# Altium project ThermalCam_Sensor.PrjPcb
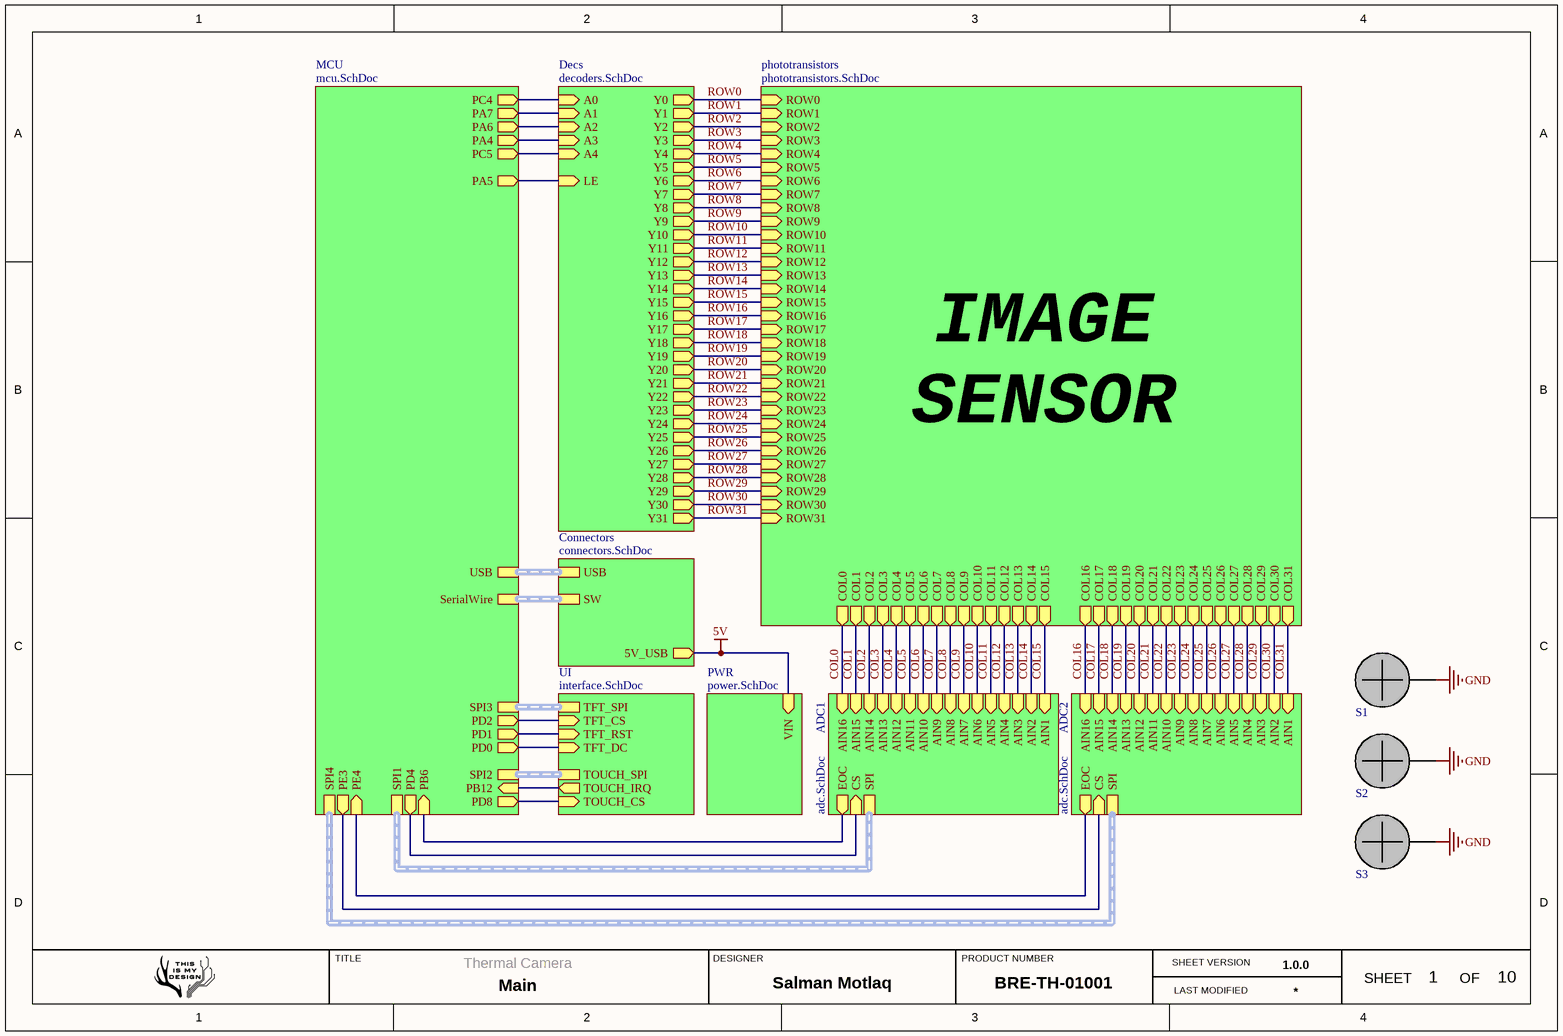
[diagram p0: main.SchDoc]
Des: Salman Motlaq; PN: BRE-TH-01001; Prj: Thermal Camera
9 sheets, 185 parts. Net scope: hierarchical (ports join the sheet entries above them; power ports are global).
Board file: thermal_cam_sensor_jlc.PcbDoc
Sheets:
  main.SchDoc
    ADC1 = adc.SchDoc
    ADC2 = adc.SchDoc
    Decs = decoders.SchDoc
      Dec0 = decoder.SchDoc
      Dec1 = decoder.SchDoc
      Dec2 = decoder.SchDoc
      Dec3 = decoder.SchDoc
      Not1 = not.SchDoc
      Not2 = not.SchDoc
    MCU = mcu.SchDoc
    UI = interface.SchDoc
    PWR = power.SchDoc
    Connectors = connectors.SchDoc

## Sheet main.SchDoc: Main
size A4; Revision: 1.0.0; SheetNumber: 1; SheetTotal: 10

### Parts
S1  Screw  [M3]  (value not drawn)  (no BOM)
S2  Screw  [M3]  (value not drawn)  (no BOM)
S3  Screw  [M3]  (value not drawn)  (no BOM)

### Sub-sheets
ADC1 = adc.SchDoc: AIN1 (in), AIN2 (in), AIN3 (in), AIN4 (in), AIN5 (in), AIN6 (in), AIN7 (in), AIN8 (in), AIN9 (in), AIN10 (in), AIN11 (in), AIN12 (in), AIN13 (in), AIN14 (in), AIN15 (in), AIN16 (in), CS (in), EOC (out), SPI (harness SPI)
ADC2 = adc.SchDoc: AIN1 (in), AIN2 (in), AIN3 (in), AIN4 (in), AIN5 (in), AIN6 (in), AIN7 (in), AIN8 (in), AIN9 (in), AIN10 (in), AIN11 (in), AIN12 (in), AIN13 (in), AIN14 (in), AIN15 (in), AIN16 (in), CS (in), EOC (out), SPI (harness SPI)
Connectors = connectors.SchDoc: USB (harness USB), 5V_USB (out), SW (harness SerialWire)
Decs = decoders.SchDoc: Y0 (out), Y1 (out), Y2 (out), Y3 (out), Y4 (out), Y5 (out), Y6 (out), Y7 (out), Y8 (out), Y9 (out), Y10 (out), Y11 (out), Y12 (out), Y13 (out), Y14 (out), Y15 (out), Y16 (out), Y17 (out), Y18 (out), Y19 (out), Y20 (out), Y21 (out), Y22 (out), Y23 (out), Y24 (out), Y25 (out), Y26 (out), Y27 (out), Y28 (out), Y29 (out), Y30 (out), Y31 (out), A0 (in), A1 (in), A2 (in), A3 (in), A4 (in), LE (in)
MCU = mcu.SchDoc: SPI1 (harness SPI), SPI4 (harness SPI), SPI2 (harness SPI), SPI3 (harness SPI), USB (harness USB), SerialWire (harness SerialWire), PD8 (out), PD0 (out), PD1 (out), PD2 (out), PB12 (in), PA4 (out), PA5 (out), PA6 (out), PA7 (out), PC4 (out), PC5 (out), PB6 (in), PD4 (out), PE4 (in), PE3 (out)
phototransistors = phototransistors.SchDoc (file not in this document): ROW1 (in), ROW2 (in), ROW3 (in), ROW4 (in), ROW5 (in), ROW6 (in), ROW7 (in), ROW8 (in), ROW9 (in), ROW10 (in), ROW11 (in), ROW12 (in), ROW13 (in), ROW14 (in), ROW15 (in), ROW16 (in), ROW17 (in), ROW18 (in), ROW19 (in), ROW20 (in), ROW21 (in), ROW22 (in), ROW23 (in), ROW24 (in), ROW25 (in), ROW26 (in), ROW27 (in), ROW28 (in), ROW29 (in), ROW30 (in), ROW31 (in), ROW0 (in), COL1 (out), COL2 (out), COL3 (out), COL4 (out), COL5 (out), COL6 (out), COL7 (out), COL8 (out), COL9 (out), COL10 (out), COL11 (out), COL12 (out), COL13 (out), COL14 (out), COL15 (out), COL0 (out), COL16 (out), COL17 (out), COL18 (out), COL19 (out), COL20 (out), COL21 (out), COL22 (out), COL23 (out), COL24 (out), COL25 (out), COL26 (out), COL27 (out), COL28 (out), COL29 (out), COL30 (out), COL31 (out)
PWR = power.SchDoc: VIN (in)
UI = interface.SchDoc: TFT_CS (in), TFT_RST (in), TFT_DC (in), TOUCH_CS (in), TOUCH_IRQ (out), TFT_SPI (harness SPI), TOUCH_SPI (harness SPI)

### Nets
5V: sheet PWR/VIN, sheet Connectors/5V_USB
GND: S1.0 S2.0 S3.0
A0: sheet Decs/A0, sheet MCU/PC4
A1: sheet Decs/A1, sheet MCU/PA7
A2: sheet Decs/A2, sheet MCU/PA6
A3: sheet Decs/A3, sheet MCU/PA4
A4: sheet Decs/A4, sheet MCU/PC5
COL0: sheet phototransistors/COL0, sheet ADC1/AIN16
COL1: sheet phototransistors/COL1, sheet ADC1/AIN15
COL2: sheet phototransistors/COL2, sheet ADC1/AIN14
COL3: sheet phototransistors/COL3, sheet ADC1/AIN13
COL4: sheet phototransistors/COL4, sheet ADC1/AIN12
COL5: sheet phototransistors/COL5, sheet ADC1/AIN11
COL6: sheet phototransistors/COL6, sheet ADC1/AIN10
COL7: sheet phototransistors/COL7, sheet ADC1/AIN9
COL8: sheet phototransistors/COL8, sheet ADC1/AIN8
COL9: sheet phototransistors/COL9, sheet ADC1/AIN7
COL10: sheet phototransistors/COL10, sheet ADC1/AIN6
COL11: sheet phototransistors/COL11, sheet ADC1/AIN5
COL12: sheet phototransistors/COL12, sheet ADC1/AIN4
COL13: sheet phototransistors/COL13, sheet ADC1/AIN3
COL14: sheet phototransistors/COL14, sheet ADC1/AIN2
COL15: sheet phototransistors/COL15, sheet ADC1/AIN1
COL16: sheet phototransistors/COL16, sheet ADC2/AIN16
COL17: sheet phototransistors/COL17, sheet ADC2/AIN15
COL18: sheet phototransistors/COL18, sheet ADC2/AIN14
COL19: sheet phototransistors/COL19, sheet ADC2/AIN13
COL20: sheet phototransistors/COL20, sheet ADC2/AIN12
COL21: sheet phototransistors/COL21, sheet ADC2/AIN11
COL22: sheet phototransistors/COL22, sheet ADC2/AIN10
COL23: sheet phototransistors/COL23, sheet ADC2/AIN9
COL24: sheet phototransistors/COL24, sheet ADC2/AIN8
COL25: sheet phototransistors/COL25, sheet ADC2/AIN7
COL26: sheet phototransistors/COL26, sheet ADC2/AIN6
COL27: sheet phototransistors/COL27, sheet ADC2/AIN5
COL28: sheet phototransistors/COL28, sheet ADC2/AIN4
COL29: sheet phototransistors/COL29, sheet ADC2/AIN3
COL30: sheet phototransistors/COL30, sheet ADC2/AIN2
COL31: sheet phototransistors/COL31, sheet ADC2/AIN1
LE: sheet Decs/LE, sheet MCU/PA5
ROW0: sheet phototransistors/ROW0, sheet Decs/Y0
ROW1: sheet phototransistors/ROW1, sheet Decs/Y1
ROW2: sheet phototransistors/ROW2, sheet Decs/Y2
ROW3: sheet phototransistors/ROW3, sheet Decs/Y3
ROW4: sheet phototransistors/ROW4, sheet Decs/Y4
ROW5: sheet phototransistors/ROW5, sheet Decs/Y5
ROW6: sheet phototransistors/ROW6, sheet Decs/Y6
ROW7: sheet phototransistors/ROW7, sheet Decs/Y7
ROW8: sheet phototransistors/ROW8, sheet Decs/Y8
ROW9: sheet phototransistors/ROW9, sheet Decs/Y9
ROW10: sheet phototransistors/ROW10, sheet Decs/Y10
ROW11: sheet phototransistors/ROW11, sheet Decs/Y11
ROW12: sheet phototransistors/ROW12, sheet Decs/Y12
ROW13: sheet phototransistors/ROW13, sheet Decs/Y13
ROW14: sheet phototransistors/ROW14, sheet Decs/Y14
ROW15: sheet phototransistors/ROW15, sheet Decs/Y15
ROW16: sheet phototransistors/ROW16, sheet Decs/Y16
ROW17: sheet phototransistors/ROW17, sheet Decs/Y17
ROW18: sheet phototransistors/ROW18, sheet Decs/Y18
ROW19: sheet phototransistors/ROW19, sheet Decs/Y19
ROW20: sheet phototransistors/ROW20, sheet Decs/Y20
ROW21: sheet phototransistors/ROW21, sheet Decs/Y21
ROW22: sheet phototransistors/ROW22, sheet Decs/Y22
ROW23: sheet phototransistors/ROW23, sheet Decs/Y23
ROW24: sheet phototransistors/ROW24, sheet Decs/Y24
ROW25: sheet phototransistors/ROW25, sheet Decs/Y25
ROW26: sheet phototransistors/ROW26, sheet Decs/Y26
ROW27: sheet phototransistors/ROW27, sheet Decs/Y27
ROW28: sheet phototransistors/ROW28, sheet Decs/Y28
ROW29: sheet phototransistors/ROW29, sheet Decs/Y29
ROW30: sheet phototransistors/ROW30, sheet Decs/Y30
ROW31: sheet phototransistors/ROW31, sheet Decs/Y31
Net1U1_20: sheet ADC1/CS, sheet MCU/PD4
Net1U1_25: sheet ADC1/EOC, sheet MCU/PB6
Net2U1_20: sheet ADC2/CS, sheet MCU/PE3
Net2U1_25: sheet ADC2/EOC, sheet MCU/PE4
NetLCD1_3: sheet MCU/PD2, sheet UI/TFT_CS
NetLCD1_4: sheet MCU/PD1, sheet UI/TFT_RST
NetLCD1_5: sheet MCU/PD0, sheet UI/TFT_DC
NetLCD1_11: sheet MCU/PD8, sheet UI/TOUCH_CS
NetLCD1_14: sheet MCU/PB12, sheet UI/TOUCH_IRQ

### Buses and harness runs
harness sheet ADC1/SPI = sheet MCU/SPI1
harness sheet ADC2/SPI = sheet MCU/SPI4
harness sheet Connectors/SW = sheet MCU/SerialWire
harness sheet Connectors/USB = sheet MCU/USB
harness sheet MCU/SPI2 = sheet UI/TOUCH_SPI
harness sheet MCU/SPI3 = sheet UI/TFT_SPI

### Notes on the sheet
- IMAGE
  SENSOR
- TITLE
- DESIGNER
- PRODUCT NUMBER
- SHEET VERSION
- LAST MODIFIED
- SHEET
- OF

## Sheet adc.SchDoc: 16 Channel ADC
size A4; Revision: 1.0.0; SheetNumber: 3; SheetTotal: 10
Used 2 times, as channels ADC1, ADC2. Parts and nets are listed once, with the designators drawn on the sheet.
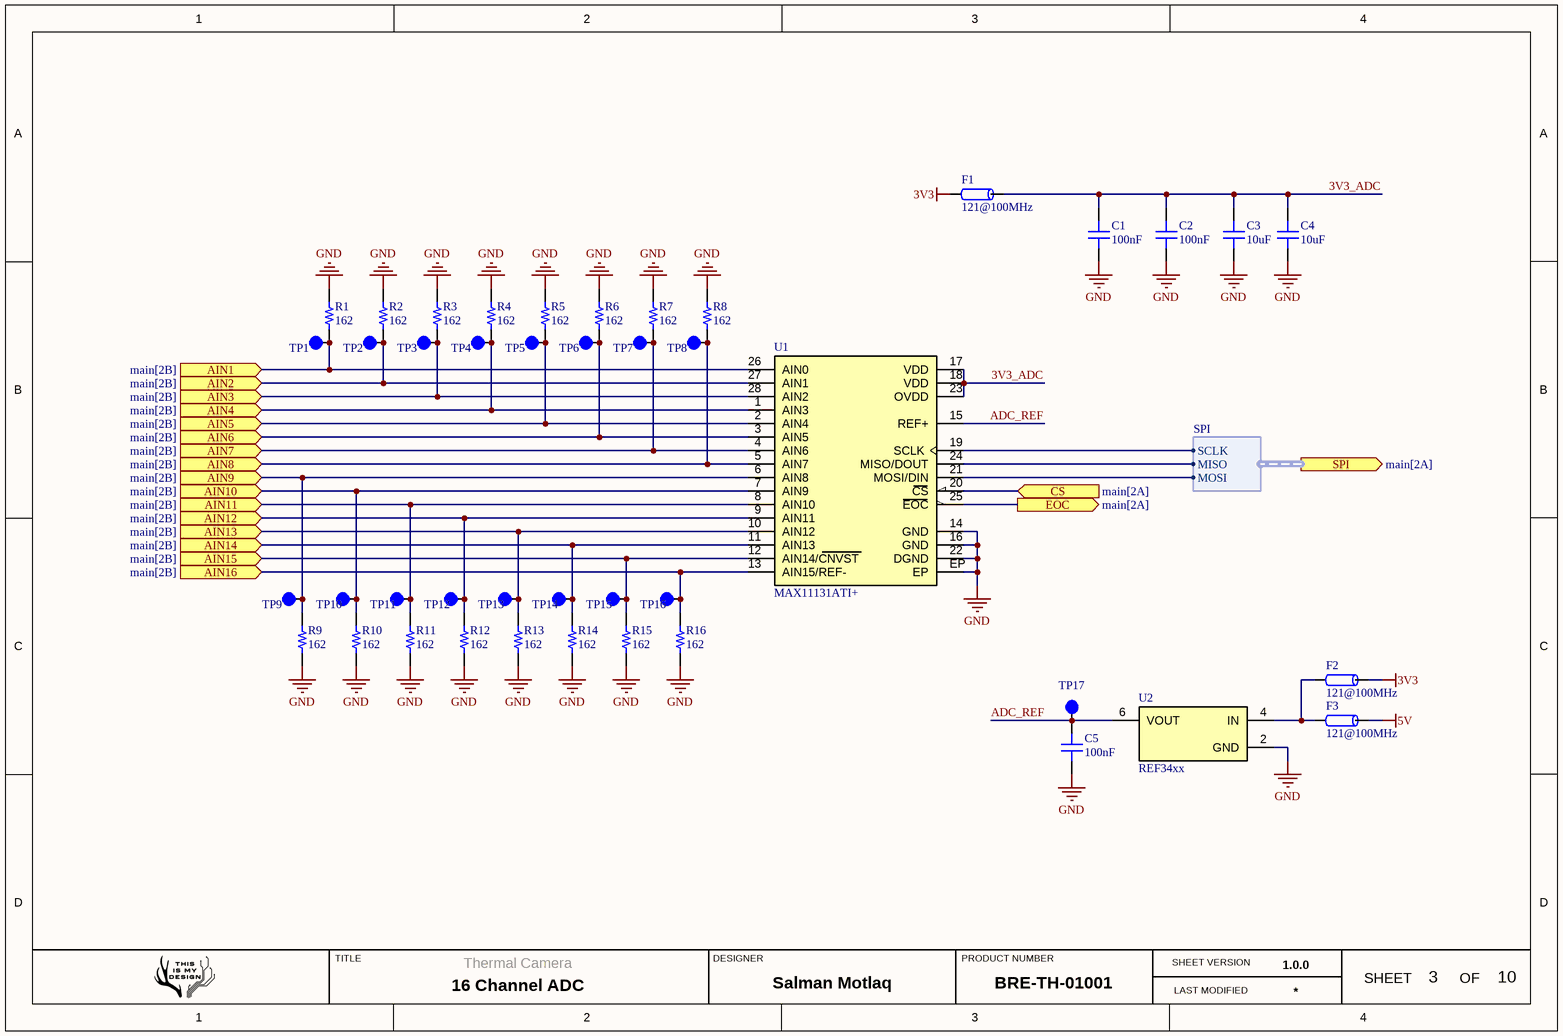
[diagram p1: adc.SchDoc]

### Parts
C1  100nF  [CAP 0603_1608]
C2  100nF  [CAP 0603_1608]
C3  10uF  [CAP 0603_1608]
C4  10uF  [CAP 0603_1608]
C5  100nF  [CAP 0603_1608]
F1  121@100MHz  [Ferrite-0805]
F2  121@100MHz  [Ferrite-0805]
F3  121@100MHz  [Ferrite-0805]
R1  162  [RES 0402_1005]
R2  162  [RES 0402_1005]
R3  162  [RES 0402_1005]
R4  162  [RES 0402_1005]
R5  162  [RES 0402_1005]
R6  162  [RES 0402_1005]
R7  162  [RES 0402_1005]
R8  162  [RES 0402_1005]
R9  162  [RES 0402_1005]
R10  162  [RES 0402_1005]
R11  162  [RES 0402_1005]
R12  162  [RES 0402_1005]
R13  162  [RES 0402_1005]
R14  162  [RES 0402_1005]
R15  162  [RES 0402_1005]
R16  162  [RES 0402_1005]
TP1  Test Point  [TEST_POINT_0R5]  (value not drawn)  (no BOM)
TP2  Test Point  [TEST_POINT_0R5]  (value not drawn)  (no BOM)
TP3  Test Point  [TEST_POINT_0R5]  (value not drawn)  (no BOM)
TP4  Test Point  [TEST_POINT_0R5]  (value not drawn)  (no BOM)
TP5  Test Point  [TEST_POINT_0R5]  (value not drawn)  (no BOM)
TP6  Test Point  [TEST_POINT_0R5]  (value not drawn)  (no BOM)
TP7  Test Point  [TEST_POINT_0R5]  (value not drawn)  (no BOM)
TP8  Test Point  [TEST_POINT_0R5]  (value not drawn)  (no BOM)
TP9  Test Point  [TEST_POINT_0R5]  (value not drawn)  (no BOM)
TP10  Test Point  [TEST_POINT_0R5]  (value not drawn)  (no BOM)
TP11  Test Point  [TEST_POINT_0R5]  (value not drawn)  (no BOM)
TP12  Test Point  [TEST_POINT_0R5]  (value not drawn)  (no BOM)
TP13  Test Point  [TEST_POINT_0R5]  (value not drawn)  (no BOM)
TP14  Test Point  [TEST_POINT_0R5]  (value not drawn)  (no BOM)
TP15  Test Point  [TEST_POINT_0R5]  (value not drawn)  (no BOM)
TP16  Test Point  [TEST_POINT_0R5]  (value not drawn)  (no BOM)
TP17  Test Point  [TEST_POINT_0R5]  (value not drawn)  (no BOM)
U1  MAX11131ATI+  [TQFN-28]
U2  REF34xx  [SOT23-6L]

### Ports
AIN1 (in, see main[2B]), AIN2 (in, see main[2B]), AIN3 (in, see main[2B]), AIN4 (in, see main[2B]), AIN5 (in, see main[2B]), AIN6 (in, see main[2B]), AIN7 (in, see main[2B]), AIN8 (in, see main[2B]), AIN9 (in, see main[2B]), AIN10 (in, see main[2B]), AIN11 (in, see main[2B]), AIN12 (in, see main[2B]), AIN13 (in, see main[2B]), AIN14 (in, see main[2B]), AIN15 (in, see main[2B]), AIN16 (in, see main[2B]), CS (in, see main[2A]), EOC (out, see main[2A]), SPI (out, harness SPI, see main[2A])

### Harnesses
SPI: SCLK, MISO, MOSI

### Nets
3V3: F1.1 F2.2
5V: F3.2
GND: C1.1 C2.1 C3.1 C4.1 C5.1 R1.2 R2.2 R3.2 R4.2 R5.2 R6.2 R7.2 R8.2 R9.1 R10.1 R11.1 R12.1 R13.1 R14.1 R15.1 R16.1 U1.14(GND) U1.16(GND) U1.22(DGND) U1.EP U2.2(GND)
3V3_ADC: C1.2 C2.2 C3.2 C4.2 F1.2 U1.17(VDD) U1.18(VDD) U1.23(OVDD)
ADC_REF: C5.2 TP17.0 U1.15(REF+) U2.6(VOUT)
AIN1: R1.1 TP1.0 U1.26(AIN0) ; port AIN1
AIN2: R2.1 TP2.0 U1.27(AIN1) ; port AIN2
AIN3: R3.1 TP3.0 U1.28(AIN2) ; port AIN3
AIN4: R4.1 TP4.0 U1.1(AIN3) ; port AIN4
AIN5: R5.1 TP5.0 U1.2(AIN4) ; port AIN5
AIN6: R6.1 TP6.0 U1.3(AIN5) ; port AIN6
AIN7: R7.1 TP7.0 U1.4(AIN6) ; port AIN7
AIN8: R8.1 TP8.0 U1.5(AIN7) ; port AIN8
AIN9: R9.2 TP9.0 U1.6(AIN8) ; port AIN9
AIN10: R10.2 TP10.0 U1.7(AIN9) ; port AIN10
AIN11: R11.2 TP11.0 U1.8(AIN10) ; port AIN11
AIN12: R12.2 TP12.0 U1.9(AIN11) ; port AIN12
AIN13: R13.2 TP13.0 U1.10(AIN12) ; port AIN13
AIN14: R14.2 TP14.0 U1.11(AIN13) ; port AIN14
AIN15: R15.2 TP15.0 U1.12(AIN14/CNVST) ; port AIN15
AIN16: R16.2 TP16.0 U1.13(AIN15/REF-) ; port AIN16
CS: U1.20(CS) ; port CS
EOC: U1.25(EOC) ; port EOC
NetF2_1: F2.1 F3.1 U2.4(IN)
NetU1_19: U1.19(SCLK) ; port SPI.SCLK
NetU1_21: U1.21(MOSI/DIN) ; port SPI.MOSI
NetU1_24: U1.24(MISO/DOUT) ; port SPI.MISO

### Channels
ADC1: designators C1=1C1 C2=1C2 C3=1C3 C4=1C4 C5=1C5 F1=1F1 F2=1F2 F3=1F3 R1=1R1 R2=1R2 R3=1R3 R4=1R4 R5=1R5 R6=1R6 R7=1R7 R8=1R8 R9=1R9 R10=1R10 R11=1R11 R12=1R12 R13=1R13 R14=1R14 R15=1R15 R16=1R16 TP1=1TP1 TP2=1TP2 TP3=1TP3 TP4=1TP4 TP5=1TP5 TP6=1TP6 TP7=1TP7 TP8=1TP8 TP9=1TP9 TP10=1TP10 TP11=1TP11 TP12=1TP12 TP13=1TP13 TP14=1TP14 TP15=1TP15 TP16=1TP16 TP17=1TP17 U1=1U1 U2=1U2; ports AIN1=COL15 AIN2=COL14 AIN3=COL13 AIN4=COL12 AIN5=COL11 AIN6=COL10 AIN7=COL9 AIN8=COL8 AIN9=COL7 AIN10=COL6 AIN11=COL5 AIN12=COL4 AIN13=COL3 AIN14=COL2 AIN15=COL1 AIN16=COL0 CS=Net1U1_20 EOC=Net1U1_25
ADC2: designators C1=2C1 C2=2C2 C3=2C3 C4=2C4 C5=2C5 F1=2F1 F2=2F2 F3=2F3 R1=2R1 R2=2R2 R3=2R3 R4=2R4 R5=2R5 R6=2R6 R7=2R7 R8=2R8 R9=2R9 R10=2R10 R11=2R11 R12=2R12 R13=2R13 R14=2R14 R15=2R15 R16=2R16 TP1=2TP1 TP2=2TP2 TP3=2TP3 TP4=2TP4 TP5=2TP5 TP6=2TP6 TP7=2TP7 TP8=2TP8 TP9=2TP9 TP10=2TP10 TP11=2TP11 TP12=2TP12 TP13=2TP13 TP14=2TP14 TP15=2TP15 TP16=2TP16 TP17=2TP17 U1=2U1 U2=2U2; ports AIN1=COL31 AIN2=COL30 AIN3=COL29 AIN4=COL28 AIN5=COL27 AIN6=COL26 AIN7=COL25 AIN8=COL24 AIN9=COL23 AIN10=COL22 AIN11=COL21 AIN12=COL20 AIN13=COL19 AIN14=COL18 AIN15=COL17 AIN16=COL16 CS=Net2U1_20 EOC=Net2U1_25

### Notes on the sheet
- TITLE
- DESIGNER
- PRODUCT NUMBER
- SHEET VERSION
- LAST MODIFIED
- SHEET
- OF

### Library data of the parts
C1-C5 = Cap 0603: SMT Capacitor
  C1 C2 C5: VALUE: 100nF
  C3 C4: VALUE: 10uF
F1-F3 = Ferrite Bead
R1-R16 = Res 0402: SMT Resistor; VALUE: 162
TP1-TP17 = Test Point: PCB Test Point
U1 = MAX11131: Analog to Digital Converters - ADC Pin-/Software-Compatible Family of 10-/12-Bit, 8-/16-Channel, 3Msps ADCs with External Reference
U2 = REF34xx: Voltage References low-drift, low-power

## Sheet decoders.SchDoc: 5-to-32 Decoder
size A4; Revision: 1.0.0; SheetNumber: 4; SheetTotal: 10
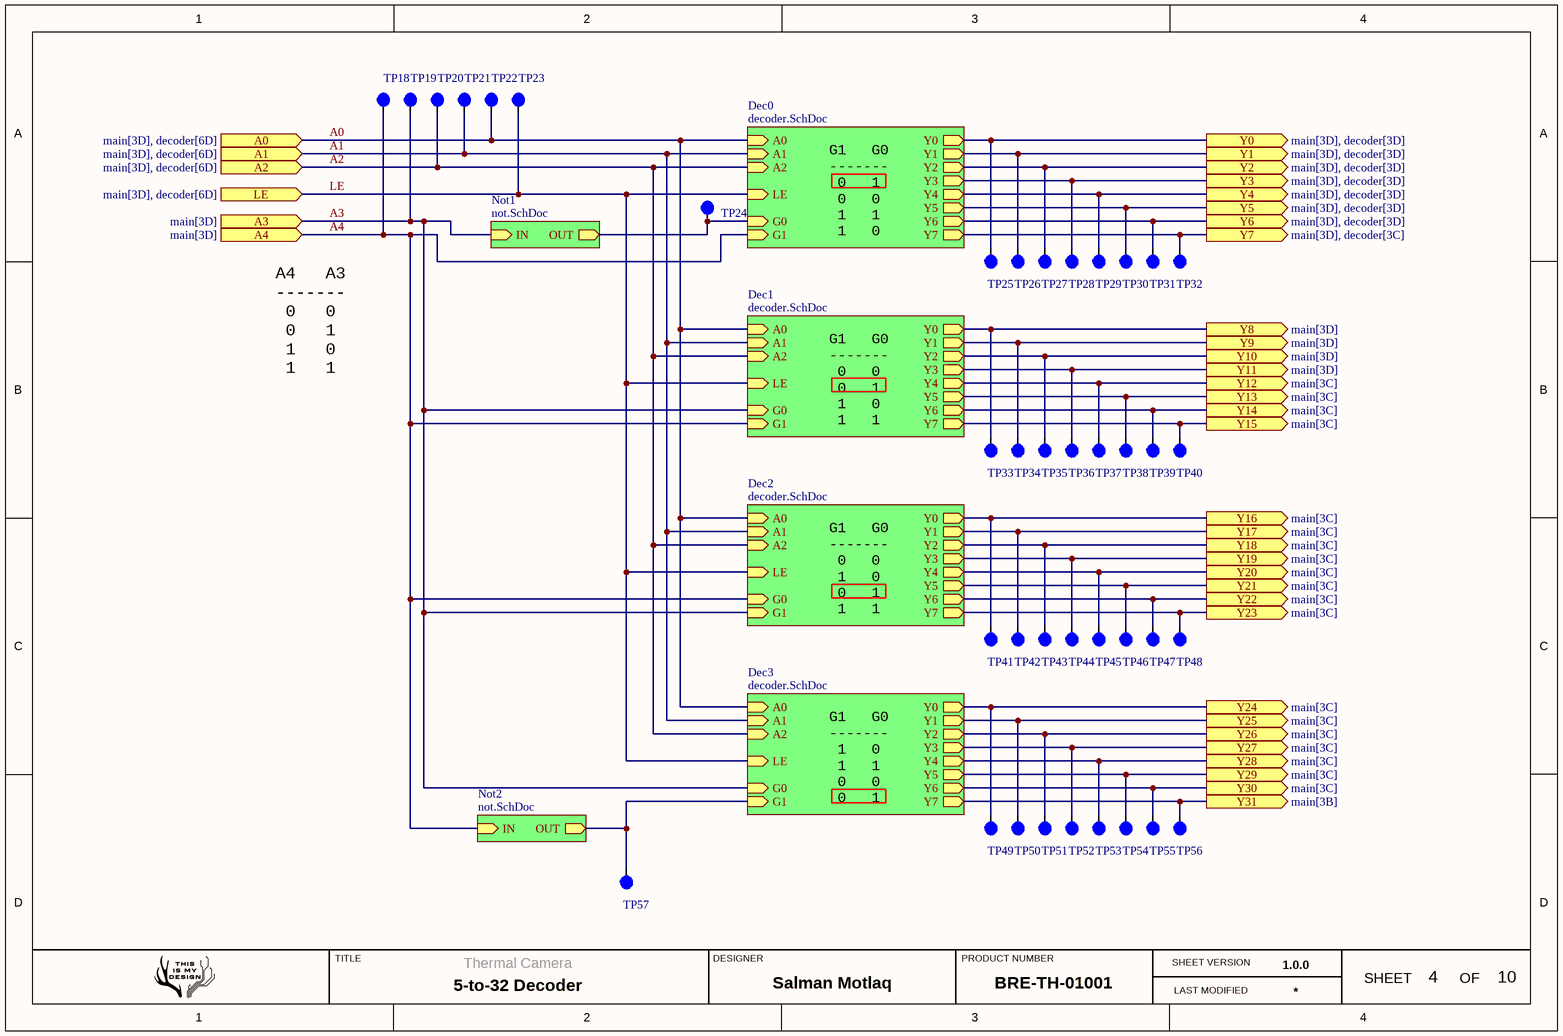
[diagram p2: decoders.SchDoc]

### Parts
TP18  Test Point  [TEST_POINT_0R5]  (value not drawn)  (no BOM)
TP19  Test Point  [TEST_POINT_0R5]  (value not drawn)  (no BOM)
TP20  Test Point  [TEST_POINT_0R5]  (value not drawn)  (no BOM)
TP21  Test Point  [TEST_POINT_0R5]  (value not drawn)  (no BOM)
TP22  Test Point  [TEST_POINT_0R5]  (value not drawn)  (no BOM)
TP23  Test Point  [TEST_POINT_0R5]  (value not drawn)  (no BOM)
TP24  Test Point  [TEST_POINT_0R5]  (value not drawn)  (no BOM)
TP25  Test Point  [TEST_POINT_0R5]  (value not drawn)  (no BOM)
TP26  Test Point  [TEST_POINT_0R5]  (value not drawn)  (no BOM)
TP27  Test Point  [TEST_POINT_0R5]  (value not drawn)  (no BOM)
TP28  Test Point  [TEST_POINT_0R5]  (value not drawn)  (no BOM)
TP29  Test Point  [TEST_POINT_0R5]  (value not drawn)  (no BOM)
TP30  Test Point  [TEST_POINT_0R5]  (value not drawn)  (no BOM)
TP31  Test Point  [TEST_POINT_0R5]  (value not drawn)  (no BOM)
TP32  Test Point  [TEST_POINT_0R5]  (value not drawn)  (no BOM)
TP33  Test Point  [TEST_POINT_0R5]  (value not drawn)  (no BOM)
TP34  Test Point  [TEST_POINT_0R5]  (value not drawn)  (no BOM)
TP35  Test Point  [TEST_POINT_0R5]  (value not drawn)  (no BOM)
TP36  Test Point  [TEST_POINT_0R5]  (value not drawn)  (no BOM)
TP37  Test Point  [TEST_POINT_0R5]  (value not drawn)  (no BOM)
TP38  Test Point  [TEST_POINT_0R5]  (value not drawn)  (no BOM)
TP39  Test Point  [TEST_POINT_0R5]  (value not drawn)  (no BOM)
TP40  Test Point  [TEST_POINT_0R5]  (value not drawn)  (no BOM)
TP41  Test Point  [TEST_POINT_0R5]  (value not drawn)  (no BOM)
TP42  Test Point  [TEST_POINT_0R5]  (value not drawn)  (no BOM)
TP43  Test Point  [TEST_POINT_0R5]  (value not drawn)  (no BOM)
TP44  Test Point  [TEST_POINT_0R5]  (value not drawn)  (no BOM)
TP45  Test Point  [TEST_POINT_0R5]  (value not drawn)  (no BOM)
TP46  Test Point  [TEST_POINT_0R5]  (value not drawn)  (no BOM)
TP47  Test Point  [TEST_POINT_0R5]  (value not drawn)  (no BOM)
TP48  Test Point  [TEST_POINT_0R5]  (value not drawn)  (no BOM)
TP49  Test Point  [TEST_POINT_0R5]  (value not drawn)  (no BOM)
TP50  Test Point  [TEST_POINT_0R5]  (value not drawn)  (no BOM)
TP51  Test Point  [TEST_POINT_0R5]  (value not drawn)  (no BOM)
TP52  Test Point  [TEST_POINT_0R5]  (value not drawn)  (no BOM)
TP53  Test Point  [TEST_POINT_0R5]  (value not drawn)  (no BOM)
TP54  Test Point  [TEST_POINT_0R5]  (value not drawn)  (no BOM)
TP55  Test Point  [TEST_POINT_0R5]  (value not drawn)  (no BOM)
TP56  Test Point  [TEST_POINT_0R5]  (value not drawn)  (no BOM)
TP57  Test Point  [TEST_POINT_0R5]  (value not drawn)  (no BOM)

### Sub-sheets
Dec0 = decoder.SchDoc: Y0 (out), Y1 (out), Y2 (out), Y3 (out), Y4 (out), Y5 (out), Y6 (out), Y7 (out), A0 (in), A1 (in), A2 (in), LE (in), G0 (in), G1 (in)
Dec1 = decoder.SchDoc: Y0 (out), Y1 (out), Y2 (out), Y3 (out), Y4 (out), Y5 (out), Y6 (out), Y7 (out), A0 (in), A1 (in), A2 (in), LE (in), G0 (in), G1 (in)
Dec2 = decoder.SchDoc: Y0 (out), Y1 (out), Y2 (out), Y3 (out), Y4 (out), Y5 (out), Y6 (out), Y7 (out), A0 (in), A1 (in), A2 (in), LE (in), G0 (in), G1 (in)
Dec3 = decoder.SchDoc: Y0 (out), Y1 (out), Y2 (out), Y3 (out), Y4 (out), Y5 (out), Y6 (out), Y7 (out), A0 (in), A1 (in), A2 (in), LE (in), G0 (in), G1 (in)
Not1 = not.SchDoc: IN (in), OUT (out)
Not2 = not.SchDoc: IN (in), OUT (out)

### Ports
A0 (in, see main[3D], decoder[6D]), A1 (in, see main[3D], decoder[6D]), A2 (in, see main[3D], decoder[6D]), A3 (in, see main[3D]), A4 (in, see main[3D]), LE (in, see main[3D], decoder[6D]), Y0 (out, see main[3D], decoder[3D]), Y1 (out, see main[3D], decoder[3D]), Y2 (out, see main[3D], decoder[3D]), Y3 (out, see main[3D], decoder[3D]), Y4 (out, see main[3D], decoder[3D]), Y5 (out, see main[3D], decoder[3D]), Y6 (out, see main[3D], decoder[3D]), Y7 (out, see main[3D], decoder[3C]), Y8 (out, see main[3D]), Y9 (out, see main[3D]), Y10 (out, see main[3D]), Y11 (out, see main[3D]), Y12 (out, see main[3C]), Y13 (out, see main[3C]), Y14 (out, see main[3C]), Y15 (out, see main[3C]), Y16 (out, see main[3C]), Y17 (out, see main[3C]), Y18 (out, see main[3C]), Y19 (out, see main[3C]), Y20 (out, see main[3C]), Y21 (out, see main[3C]), Y22 (out, see main[3C]), Y23 (out, see main[3C]), Y24 (out, see main[3C]), Y25 (out, see main[3C]), Y26 (out, see main[3C]), Y27 (out, see main[3C]), Y28 (out, see main[3C]), Y29 (out, see main[3C]), Y30 (out, see main[3C]), Y31 (out, see main[3B])

### Nets
A0: TP22.0 ; port A0, sheet Dec0/A0, sheet Dec1/A0, sheet Dec2/A0, sheet Dec3/A0
A1: TP21.0 ; port A1, sheet Dec0/A1, sheet Dec1/A1, sheet Dec2/A1, sheet Dec3/A1
A2: TP20.0 ; port A2, sheet Dec0/A2, sheet Dec1/A2, sheet Dec2/A2, sheet Dec3/A2
A3: TP19.0 ; port A3, sheet Dec1/G0, sheet Dec2/G1, sheet Dec3/G0, sheet Not1/IN
A4: TP18.0 ; port A4, sheet Dec0/G1, sheet Dec1/G1, sheet Dec2/G0, sheet Not2/IN
LE: TP23.0 ; port LE, sheet Dec0/LE, sheet Dec1/LE, sheet Dec2/LE, sheet Dec3/LE
ROW0: TP25.0 ; port Y0, sheet Dec0/Y0
ROW1: TP26.0 ; port Y1, sheet Dec0/Y1
ROW2: TP27.0 ; port Y2, sheet Dec0/Y2
ROW3: TP28.0 ; port Y3, sheet Dec0/Y3
ROW4: TP29.0 ; port Y4, sheet Dec0/Y4
ROW5: TP30.0 ; port Y5, sheet Dec0/Y5
ROW6: TP31.0 ; port Y6, sheet Dec0/Y6
ROW7: TP32.0 ; port Y7, sheet Dec0/Y7
ROW8: TP33.0 ; port Y8, sheet Dec1/Y0
ROW9: TP34.0 ; port Y9, sheet Dec1/Y1
ROW10: TP35.0 ; port Y10, sheet Dec1/Y2
ROW11: TP36.0 ; port Y11, sheet Dec1/Y3
ROW12: TP37.0 ; port Y12, sheet Dec1/Y4
ROW13: TP38.0 ; port Y13, sheet Dec1/Y5
ROW14: TP39.0 ; port Y14, sheet Dec1/Y6
ROW15: TP40.0 ; port Y15, sheet Dec1/Y7
ROW16: TP41.0 ; port Y16, sheet Dec2/Y0
ROW17: TP42.0 ; port Y17, sheet Dec2/Y1
ROW18: TP43.0 ; port Y18, sheet Dec2/Y2
ROW19: TP44.0 ; port Y19, sheet Dec2/Y3
ROW20: TP45.0 ; port Y20, sheet Dec2/Y4
ROW21: TP46.0 ; port Y21, sheet Dec2/Y5
ROW22: TP47.0 ; port Y22, sheet Dec2/Y6
ROW23: TP48.0 ; port Y23, sheet Dec2/Y7
ROW24: TP49.0 ; port Y24, sheet Dec3/Y0
ROW25: TP50.0 ; port Y25, sheet Dec3/Y1
ROW26: TP51.0 ; port Y26, sheet Dec3/Y2
ROW27: TP52.0 ; port Y27, sheet Dec3/Y3
ROW28: TP53.0 ; port Y28, sheet Dec3/Y4
ROW29: TP54.0 ; port Y29, sheet Dec3/Y5
ROW30: TP55.0 ; port Y30, sheet Dec3/Y6
ROW31: TP56.0 ; port Y31, sheet Dec3/Y7
Net1U3_6: TP24.0 ; sheet Dec0/G0, sheet Not1/OUT
Net2U4_4: TP57.0 ; sheet Dec3/G1, sheet Not2/OUT

### Notes on the sheet
- G1   G0
  -------
  0   1
  0   0
  1   1
  1   0
- A4   A3
  -------
  0   0
  0   1
  1   0
  1   1
- G1   G0
  -------
  0   0
  0   1
  1   0
  1   1
- G1   G0
  -------
  0   0
  1   0
  0   1
  1   1
- G1   G0
  -------
  1   0
  1   1
  0   0
  0   1
- TITLE
- DESIGNER
- PRODUCT NUMBER
- SHEET VERSION
- LAST MODIFIED
- SHEET
- OF

### Library data of the parts
TP18-TP57 = Test Point: PCB Test Point

## Sheet decoder.SchDoc: 3-to-8 Decoder
size 209 x 148 mm; Revision: 1.0.0; SheetNumber: 5; SheetTotal: 10
Used 4 times, as channels Decs/Dec0, Decs/Dec1, Decs/Dec2, Decs/Dec3. Parts and nets are listed once, with the designators drawn on the sheet.
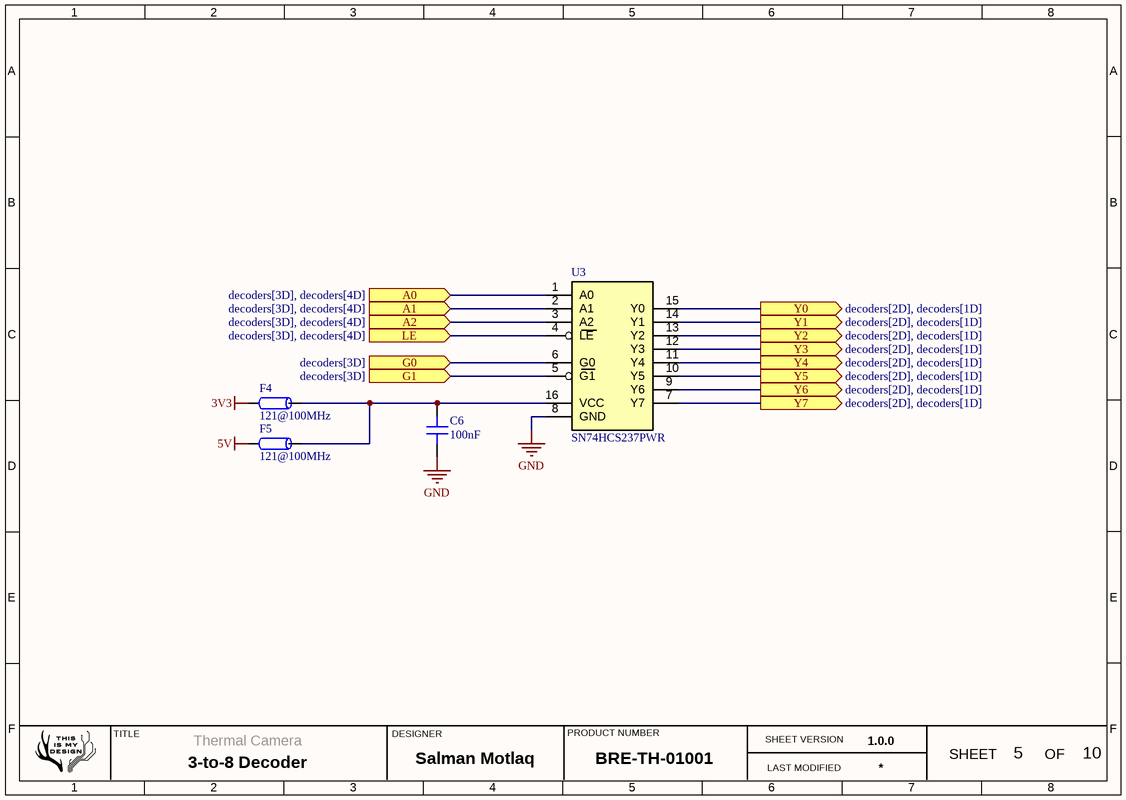
[diagram p3: decoder.SchDoc]

### Parts
C6  100nF  [CAP 0603_1608]
F4  121@100MHz  [Ferrite-0805]
F5  121@100MHz  [Ferrite-0805]
U3  SN74HCS237PWR  [TSSOP-16]

### Ports
A0 (in, see decoders[3D], decoders[4D]), A1 (in, see decoders[3D], decoders[4D]), A2 (in, see decoders[3D], decoders[4D]), G0 (in, see decoders[3D]), G1 (in, see decoders[3D]), LE (in, see decoders[3D], decoders[4D]), Y0 (out, see decoders[2D], decoders[1D]), Y1 (out, see decoders[2D], decoders[1D]), Y2 (out, see decoders[2D], decoders[1D]), Y3 (out, see decoders[2D], decoders[1D]), Y4 (out, see decoders[2D], decoders[1D]), Y5 (out, see decoders[2D], decoders[1D]), Y6 (out, see decoders[2D], decoders[1D]), Y7 (out, see decoders[2D], decoders[1D])

### Nets
3V3: F4.1
5V: F5.1
GND: C6.1 U3.8(GND)
A0: U3.1(A0) ; port A0
A1: U3.2(A1) ; port A1
A2: U3.3(A2) ; port A2
G0: U3.6(G0) ; port G0
G1: U3.5(G1) ; port G1
LE: U3.4(LE) ; port LE
Y0: U3.15(Y0) ; port Y0
Y1: U3.14(Y1) ; port Y1
Y2: U3.13(Y2) ; port Y2
Y3: U3.12(Y3) ; port Y3
Y4: U3.11(Y4) ; port Y4
Y5: U3.10(Y5) ; port Y5
Y6: U3.9(Y6) ; port Y6
Y7: U3.7(Y7) ; port Y7
NetC6_2: C6.2 F4.2 F5.2 U3.16(VCC)

### Channels
Decs/Dec0: designators C6=1C6 F4=1F4 F5=1F5 U3=1U3; ports A0=A0 A1=A1 A2=A2 G0=Net1U3_6 G1=A4 LE=LE Y0=ROW0 Y1=ROW1 Y2=ROW2 Y3=ROW3 Y4=ROW4 Y5=ROW5 Y6=ROW6 Y7=ROW7
Decs/Dec1: designators C6=2C6 F4=2F4 F5=2F5 U3=2U3; ports A0=A0 A1=A1 A2=A2 G0=A3 G1=A4 LE=LE Y0=ROW8 Y1=ROW9 Y2=ROW10 Y3=ROW11 Y4=ROW12 Y5=ROW13 Y6=ROW14 Y7=ROW15
Decs/Dec2: designators C6=3C6 F4=3F4 F5=3F5 U3=3U3; ports A0=A0 A1=A1 A2=A2 G0=A4 G1=A3 LE=LE Y0=ROW16 Y1=ROW17 Y2=ROW18 Y3=ROW19 Y4=ROW20 Y5=ROW21 Y6=ROW22 Y7=ROW23
Decs/Dec3: designators C6=4C6 F4=4F4 F5=4F5 U3=4U3; ports A0=A0 A1=A1 A2=A2 G0=A3 G1=Net2U4_4 LE=LE Y0=ROW24 Y1=ROW25 Y2=ROW26 Y3=ROW27 Y4=ROW28 Y5=ROW29 Y6=ROW30 Y7=ROW31

### Notes on the sheet
- TITLE
- DESIGNER
- PRODUCT NUMBER
- SHEET VERSION
- SHEET
- OF
- LAST MODIFIED

### Library data of the parts
C6 = Cap 0603: SMT Capacitor; VALUE: 100nF
F4 F5 = Ferrite Bead
U3 = SN74HCS237: High speed CMOS logic 3-to-8 line decoder demultiplexer with address latches

## Sheet not.SchDoc: NOT Gate
size 209 x 148 mm; Revision: 1.0.0; SheetNumber: 6; SheetTotal: 10
Used 2 times, as channels Decs/Not1, Decs/Not2. Parts and nets are listed once, with the designators drawn on the sheet.
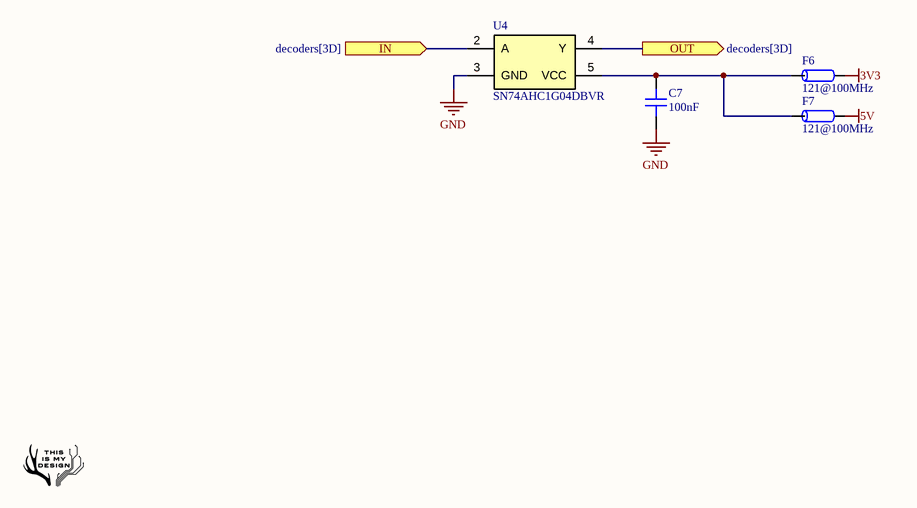
[diagram p4: not.SchDoc]

### Parts
C7  100nF  [CAP 0603_1608]
F6  121@100MHz  [Ferrite-0805]
F7  121@100MHz  [Ferrite-0805]
U4  SN74AHC1G04DBVR  [SOT23-5L]

### Ports
IN (in, see decoders[3D]), OUT (out, see decoders[3D])

### Nets
3V3: F6.1
5V: F7.1
GND: C7.1 U4.3(GND)
IN: U4.2(A) ; port IN
OUT: U4.4(Y) ; port OUT
NetC7_2: C7.2 F6.2 F7.2 U4.5(VCC)

### Channels
Decs/Not1: designators C7=1C7 F6=1F6 F7=1F7 U4=1U4; ports IN=A3 OUT=Net1U3_6
Decs/Not2: designators C7=2C7 F6=2F6 F7=2F7 U4=2U4; ports IN=A4 OUT=Net2U4_4

### Notes on the sheet
- TITLE
- DESIGNER
- PRODUCT NUMBER
- SHEET VERSION
- SHEET
- OF
- LAST MODIFIED

### Library data of the parts
C7 = Cap 0603: SMT Capacitor; VALUE: 100nF
F6 F7 = Ferrite Bead
U4 = SN74AHC1G04: Single input NOT gate

## Sheet mcu.SchDoc: MCU (STM32G474VET6)
size A3; Revision: 1.0.0; SheetNumber: 7; SheetTotal: 10
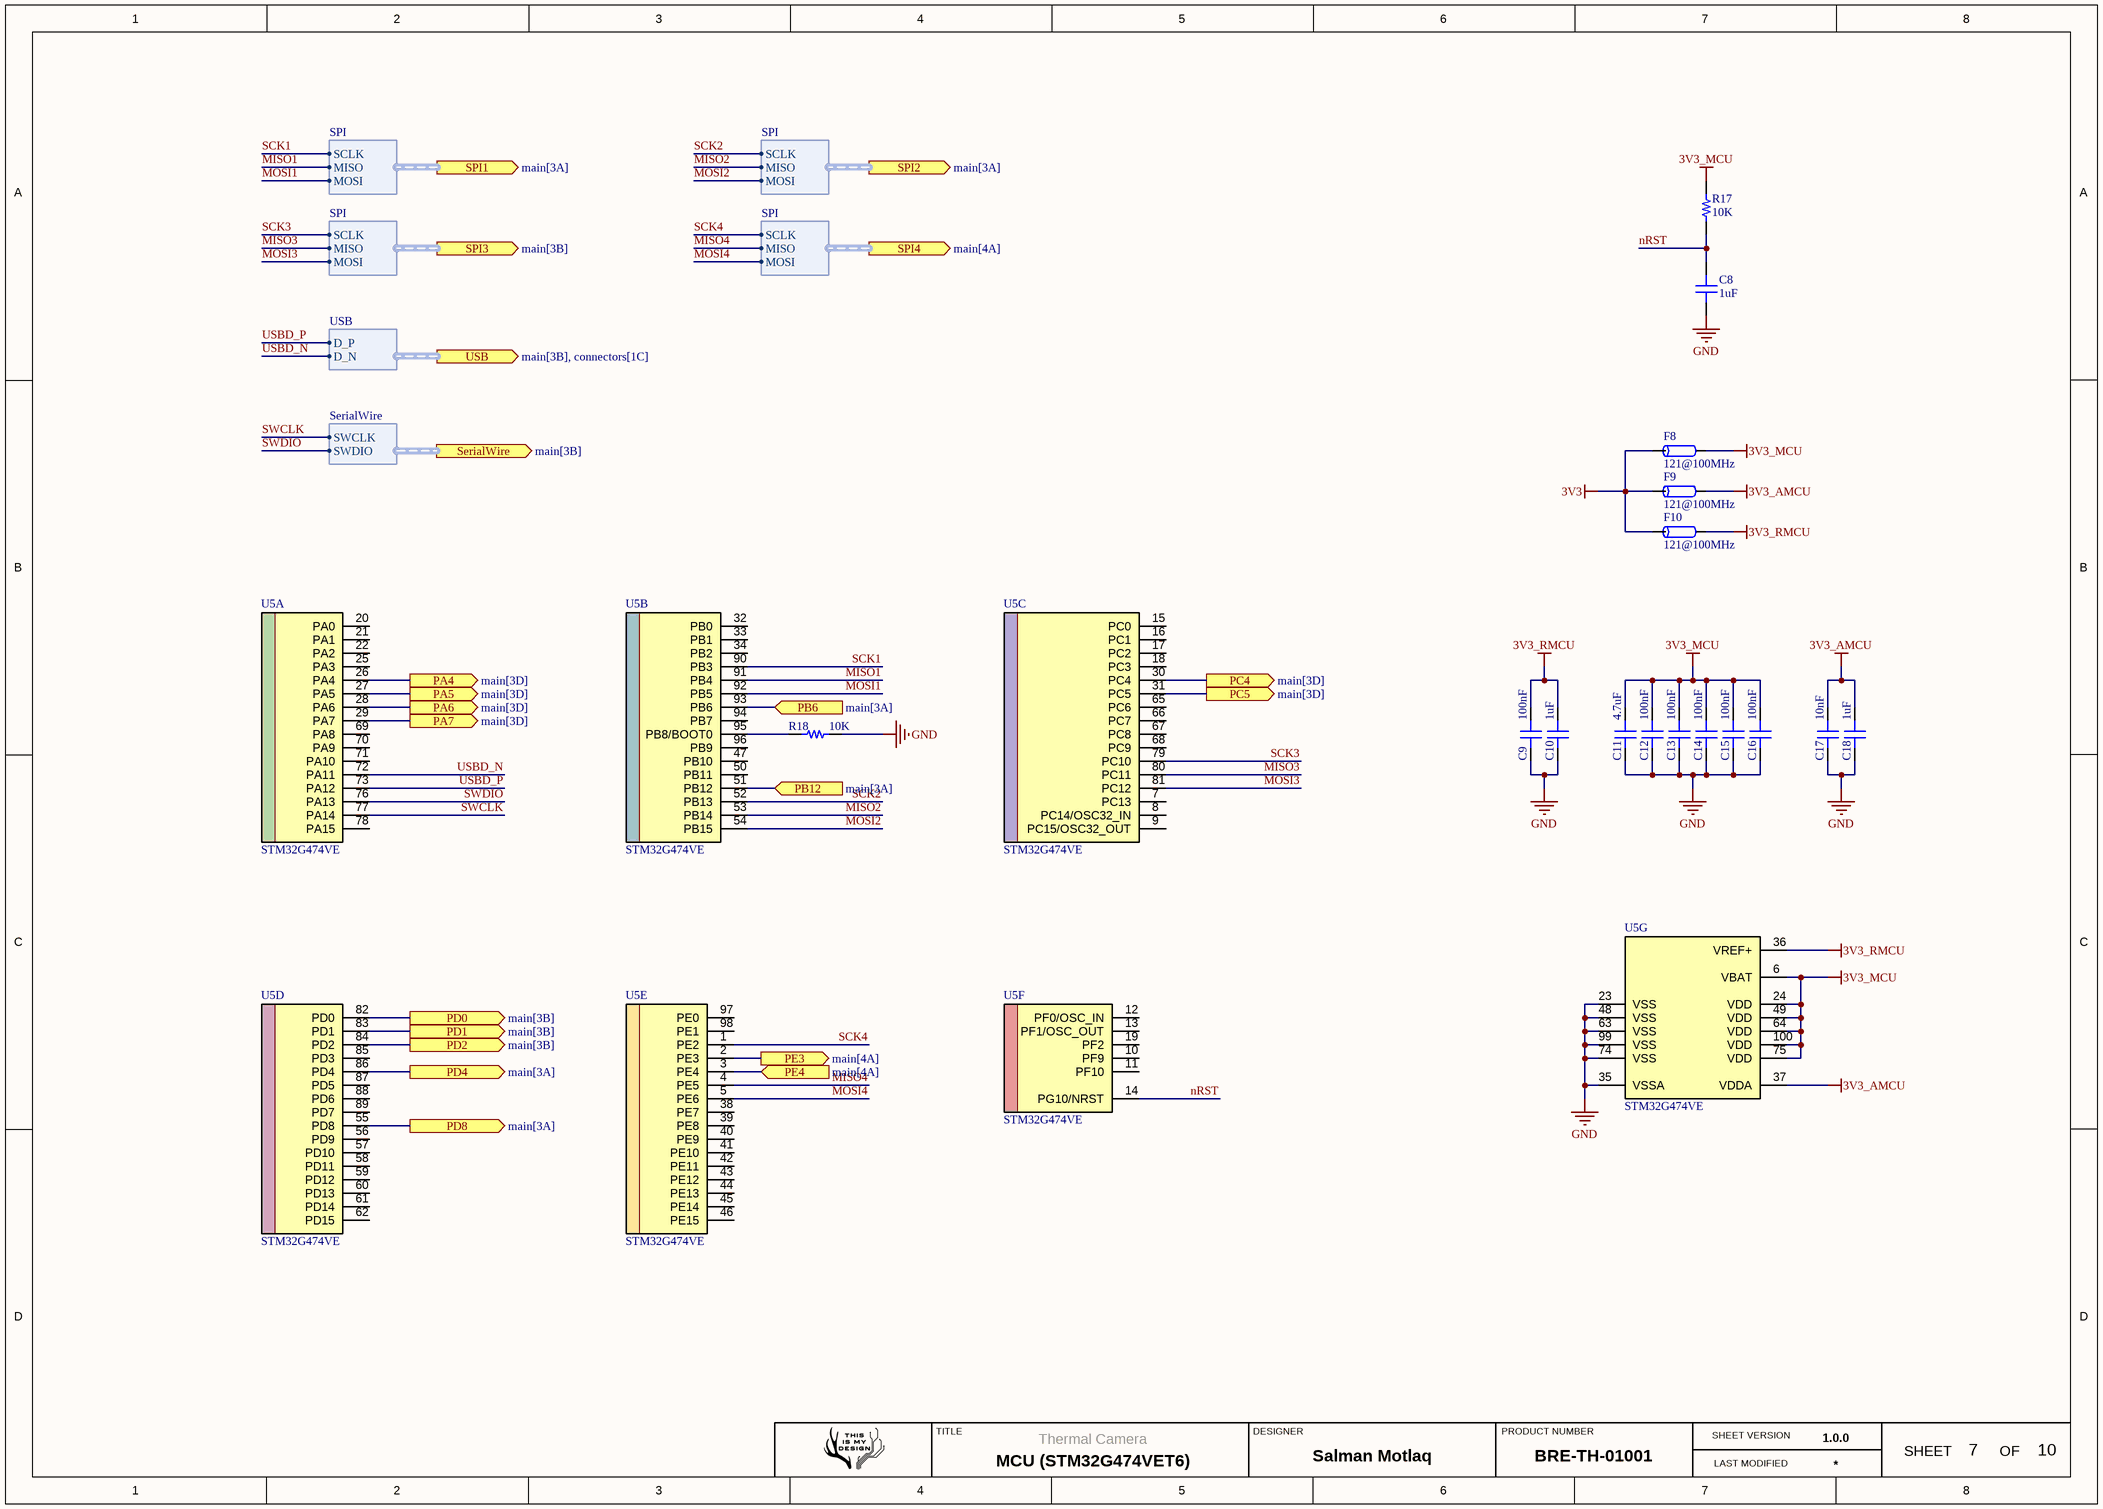
[diagram p5: mcu.SchDoc]

### Parts
C8  1uF  [CAP 0603_1608]
C9  100nF  [CAP 0603_1608]
C10  1uF  [CAP 0603_1608]
C11  4.7uF  [CAP 0805_2012]
C12  100nF  [CAP 0603_1608]
C13  100nF  [CAP 0603_1608]
C14  100nF  [CAP 0603_1608]
C15  100nF  [CAP 0603_1608]
C16  100nF  [CAP 0603_1608]
C17  10nF  [CAP 0603_1608]
C18  1uF  [CAP 0603_1608]
F8  121@100MHz  [Ferrite-0805]
F9  121@100MHz  [Ferrite-0805]
F10  121@100MHz  [Ferrite-0805]
R17  10K  [RES 0603_1608]
R18  10K  [RES 0402_1005]
U5  STM32G474VE  [LQFP100]  (parts A,B,C,D,E,F,G of 7)

### Ports
PA4 (out, see main[3D]), PA5 (out, see main[3D]), PA6 (out, see main[3D]), PA7 (out, see main[3D]), PB6 (in, see main[3A]), PB12 (in, see main[3A]), PC4 (out, see main[3D]), PC5 (out, see main[3D]), PD0 (out, see main[3B]), PD1 (out, see main[3B]), PD2 (out, see main[3B]), PD4 (out, see main[3A]), PD8 (out, see main[3A]), PE3 (out, see main[4A]), PE4 (in, see main[4A]), SerialWire (out, harness SerialWire, see main[3B]), SPI1 (out, harness SPI, see main[3A]), SPI2 (out, harness SPI, see main[3A]), SPI3 (out, harness SPI, see main[3B]), SPI4 (out, harness SPI, see main[4A]), USB (out, harness USB, see main[3B], connectors[1C])

### Harnesses
SPI: SCLK, MISO, MOSI
USB: D_P, D_N
SerialWire: SWCLK, SWDIO

### Nets
3V3: F8.2 F9.2 F10.2
3V3_AMCU: C17.2 C18.2 F9.1 U5.37(VDDA)
3V3_MCU: C11.2 C12.2 C13.2 C14.2 C15.2 C16.2 F8.1 R17.2 U5.6(VBAT) U5.24(VDD) U5.49(VDD) U5.64(VDD) U5.75(VDD) U5.100(VDD)
3V3_RMCU: C9.2 C10.2 F10.1 U5.36(VREF+)
GND: C8.1 C9.1 C10.1 C11.1 C12.1 C13.1 C14.1 C15.1 C16.1 C17.1 C18.1 R18.2 U5.23(VSS) U5.35(VSSA) U5.48(VSS) U5.63(VSS) U5.74(VSS) U5.99(VSS)
A0: U5.30(PC4) ; port PC4
A1: U5.29(PA7) ; port PA7
A2: U5.28(PA6) ; port PA6
A3: U5.26(PA4) ; port PA4
A4: U5.31(PC5) ; port PC5
LE: U5.27(PA5) ; port PA5
MISO1: U5.91(PB4) ; port SPI1.MISO
MISO2: U5.53(PB14) ; port SPI2.MISO
MISO3: U5.80(PC11) ; port SPI3.MISO
MISO4: U5.4(PE5) ; port SPI4.MISO
MOSI1: U5.92(PB5) ; port SPI1.MOSI
MOSI2: U5.54(PB15) ; port SPI2.MOSI
MOSI3: U5.81(PC12) ; port SPI3.MOSI
MOSI4: U5.5(PE6) ; port SPI4.MOSI
nRST: C8.2 R17.1 U5.14(PG10/NRST)
SCK1: U5.90(PB3) ; port SPI1.SCLK
SCK2: U5.52(PB13) ; port SPI2.SCLK
SCK3: U5.79(PC10) ; port SPI3.SCLK
SCK4: U5.1(PE2) ; port SPI4.SCLK
SWCLK: U5.77(PA14) ; port SerialWire.SWCLK
SWDIO: U5.76(PA13) ; port SerialWire.SWDIO
USBD_N: U5.72(PA11) ; port USB.D_N
USBD_P: U5.73(PA12) ; port USB.D_P
Net1U1_20: U5.86(PD4) ; port PD4
Net1U1_25: U5.93(PB6) ; port PB6
Net2U1_20: U5.2(PE3) ; port PE3
Net2U1_25: U5.3(PE4) ; port PE4
NetLCD1_3: U5.84(PD2) ; port PD2
NetLCD1_4: U5.83(PD1) ; port PD1
NetLCD1_5: U5.82(PD0) ; port PD0
NetLCD1_11: U5.55(PD8) ; port PD8
NetLCD1_14: U5.51(PB12) ; port PB12
NetR18_1: R18.1 U5.95(PB8/BOOT0)

Not connected (* = marked no-connect by the designer): U5 7(PC13) 8(PC14/OSC32_IN) 9(PC15/OSC32_OUT) 10(PF9) 11(PF10) 12(PF0/OSC_IN) 13(PF1/OSC_OUT) 15(PC0) 16(PC1) 17(PC2) 18(PC3) 19(PF2) 20(PA0) 21(PA1) 22(PA2) 25(PA3) 32(PB0) 33(PB1) 34(PB2) 38(PE7) 39(PE8) 40(PE9) 41(PE10) 42(PE11) 43(PE12) 44(PE13) 45(PE14) 46(PE15) 47(PB10) 50(PB11) 56(PD9) 57(PD10) 58(PD11) 59(PD12) 60(PD13) 61(PD14) 62(PD15) 65(PC6) 66(PC7) 67(PC8) 68(PC9) 69(PA8) 70(PA9) 71(PA10) 78(PA15) 85(PD3) 87(PD5) 88(PD6) 89(PD7) 94(PB7) 96(PB9) 97(PE0) 98(PE1)

### Notes on the sheet
- TITLE
- DESIGNER
- PRODUCT NUMBER
- SHEET VERSION
- LAST MODIFIED
- SHEET
- OF

### Library data of the parts
C8-C10 C12-C18 = Cap 0603: SMT Capacitor
  C8 C10 C18: VALUE: 1uF
  C9 C12-C16: VALUE: 100nF
  C17: VALUE: 10nF
C11 = Cap 0805: SMT Capacitor; VALUE: 4.7uF
F8-F10 = Ferrite Bead
R17 = Res 0603: SMT Resistor; VALUE: 10K
R18 = Res 0402: SMT Resistor; VALUE: 10K
U5 = STM32G474VE: Mainstream Arm Cortex-M4 MCU 170 MHz with 512 Kbytes of Flash memory, Math Accelerator, HR Timer, High Analog level integration

## Sheet interface.SchDoc: User Interface
size 148 x 209 mm; Revision: 1.0.0; SheetNumber: 9; SheetTotal: 10
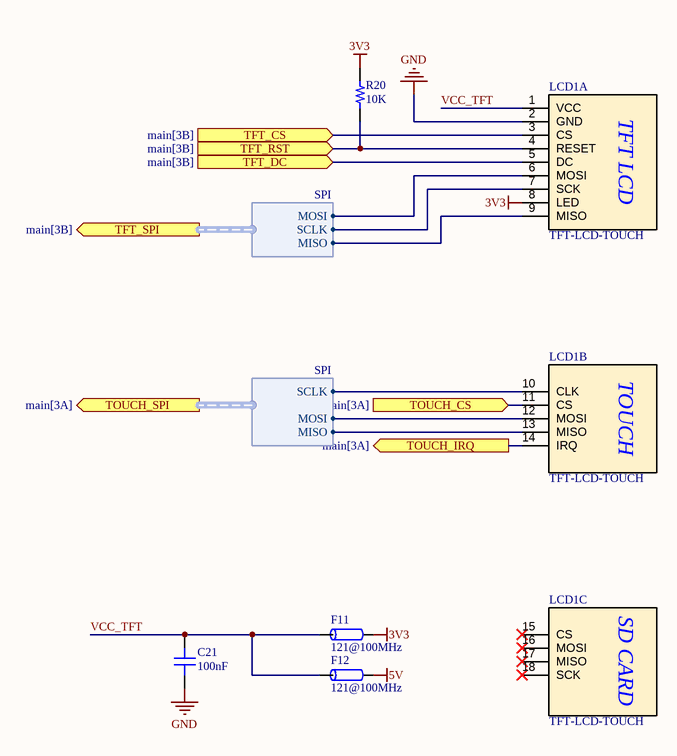
[diagram p6: interface.SchDoc]

### Parts
C21  100nF  [CAP 0603_1608]
F11  121@100MHz  [Ferrite-0805]
F12  121@100MHz  [Ferrite-0805]
LCD1  TFT-LCD-TOUCH  [TFT-2.8"-NO-SCREWS]  (parts A,B,C of 3)
R20  10K  [RES 0603_1608]

### Ports
TFT_CS (in, see main[3B]), TFT_DC (in, see main[3B]), TFT_RST (in, see main[3B]), TFT_SPI (out, harness SPI, see main[3B]), TOUCH_CS (in, see main[3A]), TOUCH_IRQ (out, see main[3A]), TOUCH_SPI (out, harness SPI, see main[3A])

### Harnesses
SPI: MISO, MOSI, SCLK

### Nets
3V3: F11.1 LCD1.8(LED) R20.2
5V: F12.1
GND: C21.1 LCD1.2(GND)
MISO2: LCD1.13(MISO) ; port TOUCH_SPI.MISO
MISO3: LCD1.9(MISO) ; port TFT_SPI.MISO
MOSI2: LCD1.12(MOSI) ; port TOUCH_SPI.MOSI
MOSI3: LCD1.6(MOSI) ; port TFT_SPI.MOSI
SCK2: LCD1.10(CLK) ; port TOUCH_SPI.SCLK
SCK3: LCD1.7(SCK) ; port TFT_SPI.SCLK
VCC_TFT: C21.2 F11.2 F12.2 LCD1.1(VCC)
NetLCD1_3: LCD1.3(CS) ; port TFT_CS
NetLCD1_4: LCD1.4(RESET) R20.1 ; port TFT_RST
NetLCD1_5: LCD1.5(DC) ; port TFT_DC
NetLCD1_11: LCD1.11(CS) ; port TOUCH_CS
NetLCD1_14: LCD1.14(IRQ) ; port TOUCH_IRQ

Not connected (* = marked no-connect by the designer): LCD1 15(CS)* 16(MOSI)* 17(MISO)* 18(SCK)*

### Notes on the sheet
- TITLE
- DESIGNER
- PRODUCT NUMBER
- SHEET VERSION
- SHEET
- OF
- LAST MODIFIED
- (in symbol TFT-LCD-TOUCH, part A) TFT LCD
- (in symbol TFT-LCD-TOUCH, part B) TOUCH
- (in symbol TFT-LCD-TOUCH, part C) SD CARD

### Library data of the parts
C21 = Cap 0603: SMT Capacitor; VALUE: 100nF
F11 F12 = Ferrite Bead
R20 = Res 0603: SMT Resistor; VALUE: 10K

## Sheet power.SchDoc: Power
size 209 x 148 mm; Revision: 1.0.0; SheetNumber: 8; SheetTotal: 10
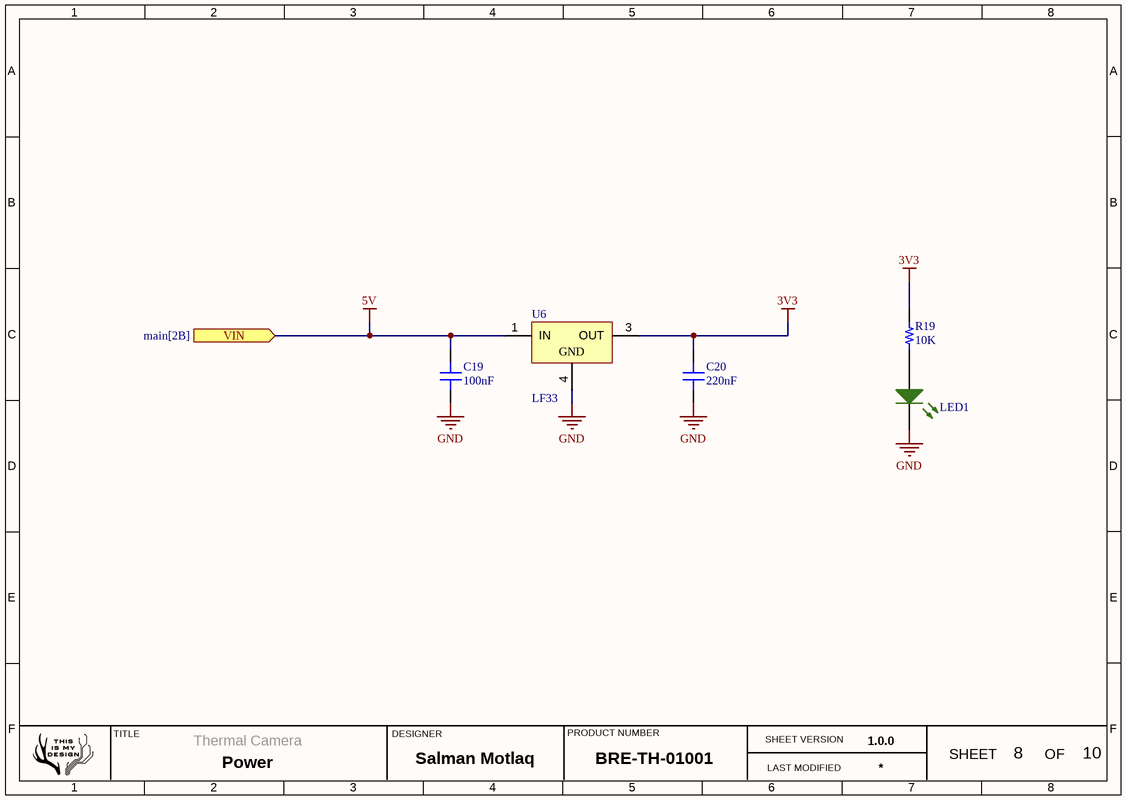
[diagram p7: power.SchDoc]

### Parts
C19  100nF  [CAP 0603_1608]
C20  220nF  [CAP 0603_1608]
LED1  LED SMD 0603 GREEN  [LED_0603_GREEN]  (value not drawn)
R19  10K  [RES 0603_1608]
U6  LF33  [TO-252]

### Ports
VIN (in, see main[2B])

### Nets
3V3: C20.2 R19.1 U6.3(OUT)
5V: C19.2 U6.1(IN) ; port VIN
GND: C19.1 C20.1 LED1.2(K) U6.4(GND)
NetLED1_1: LED1.1(A) R19.2

### Notes on the sheet
- TITLE
- DESIGNER
- PRODUCT NUMBER
- SHEET VERSION
- SHEET
- OF
- LAST MODIFIED

### Library data of the parts
C19 C20 = Cap 0603: SMT Capacitor
  C19: VALUE: 100nF
  C20: VALUE: 220nF
R19 = Res 0603: SMT Resistor; VALUE: 10K
U6 = LF33 (SMD): 500mA, Very Low Drop (0.45V) Voltage Regulator, 3.3V, 3-Pin DPAK, Tape and Reel; PartNumber: LF33CDT-TR; DatasheetVersion: Nov-2010; PackageVersion: 2011; PackageReference: TO-252; PackageDescription: 3-Pin Transistor Outline Package 2.28 mm Pitch, 9.7 mm Lead Span (DPAK); ComponentLink1Description: Manufacturer URL; ComponentLink1URL: http://www.st.com; ComponentLink2Description: Datasheet; ComponentLink2URL: http://www.st.com/internet/com/TECHNICAL_RESOURCES/TECHNICAL_LITERATURE/DATASHEET/CD00000546.pdf

## Sheet connectors.SchDoc: Connectors
size A4; Revision: 1.0.0; SheetNumber: 10; SheetTotal: 10
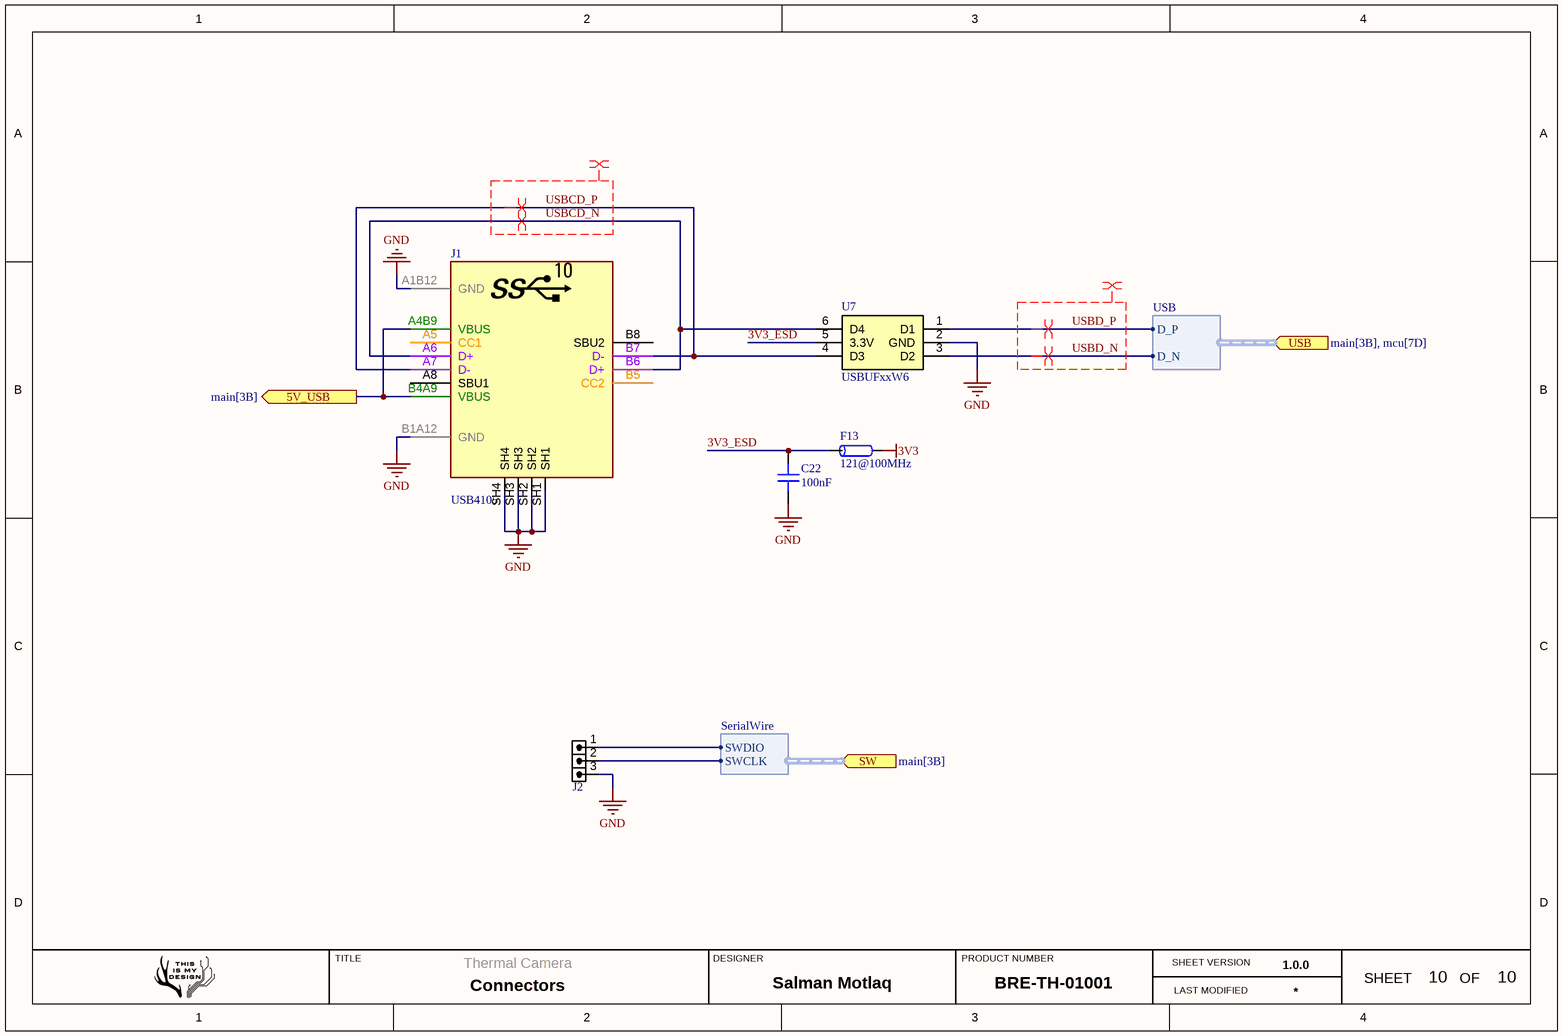
[diagram p8: connectors.SchDoc]

### Parts
C22  100nF  [CAP 0603_1608]
F13  121@100MHz  [Ferrite-0805]
J1  USB4105  [USBC_SMD_16_USB4105]
J2  HDRM3  [HDRR_M_1X3]  (value not drawn)
U7  USBUFxxW6  [SOT23-6L]

### Ports
5V_USB (out, see main[3B]), SW (in, harness SerialWire, see main[3B]), USB (in, harness USB, see main[3B], mcu[7D])

### Harnesses
USB: D_N, D_P
SerialWire: SWDIO, SWCLK

### Nets
3V3: F13.1
5V: J1.A4B9(VBUS) J1.B4A9(VBUS) ; port 5V_USB
GND: C22.1 J1.A1B12(GND) J1.B1A12(GND) J1.SH1 J1.SH2 J1.SH3 J1.SH4 J2.3 U7.2(GND)
3V3_ESD: C22.2 F13.2 U7.5(3.3V)
SWCLK: J2.2 ; port SW.SWCLK
SWDIO: J2.1 ; port SW.SWDIO
USBCD_N: J1.A6(D+) J1.B6(D+) U7.6(D4)
USBCD_P: J1.A7(D-) J1.B7(D-) U7.4(D3)
USBD_N: U7.3(D2) ; port USB.D_N
USBD_P: U7.1(D1) ; port USB.D_P

Not connected (* = marked no-connect by the designer): J1 A5(CC1) A8(SBU1) B5(CC2) B8(SBU2)

### Layout directives
differential pair: USBCD_N, USBCD_P, USBD_N, USBD_P
net class DIFF90: USBCD_N, USBCD_P, USBD_N, USBD_P

### Notes on the sheet
- TITLE
- DESIGNER
- PRODUCT NUMBER
- SHEET VERSION
- LAST MODIFIED
- SHEET
- OF

### Library data of the parts
C22 = Cap 0603: SMT Capacitor; VALUE: 100nF
F13 = Ferrite Bead
J1 = CONN_USBC_SMD_16_USB4105: CONN, USB, Type C, USB 2.0, Right-Angle, SMD; MANF: GCT; MANF_P#: USB4105-GF-A; PARAM: 5A; Price: 1.5$; Value: USB4105
J2 = HDRR_M_1X3: CONN, HEADER, RightAngle, Male, pitch: 2.54mm, 3POS; VALUE: HDRM3
U7 = USBUFxxW6: USBUF02W6

## Nets that join several sheets
3V3: ADC1 (1F1.1 1F2.2), ADC2 (2F1.1 2F2.2), Decs/Dec0 (1F4.1), Decs/Dec1 (2F4.1), Decs/Dec2 (3F4.1), Decs/Dec3 (4F4.1), Decs/Not1 (1F6.1), Decs/Not2 (2F6.1), mcu (F8.2 F9.2 F10.2), interface (F11.1 LCD1.8 R20.2), power (C20.2 R19.1 U6.3), connectors (F13.1)
5V: ADC1 (1F3.2), ADC2 (2F3.2), Decs/Dec0 (1F5.1), Decs/Dec1 (2F5.1), Decs/Dec2 (3F5.1), Decs/Dec3 (4F5.1), Decs/Not1 (1F7.1), Decs/Not2 (2F7.1), interface (F12.1), power (C19.2 U6.1), connectors (J1.A4B9 J1.B4A9)
GND: main (S1.0 S2.0 S3.0), ADC1 (26 pins), ADC2 (26 pins), Decs/Dec0 (1C6.1 1U3.8), Decs/Dec1 (2C6.1 2U3.8), Decs/Dec2 (3C6.1 3U3.8), Decs/Dec3 (4C6.1 4U3.8), Decs/Not1 (1C7.1 1U4.3), Decs/Not2 (2C7.1 2U4.3), mcu (18 pins), interface (C21.1 LCD1.2), power (C19.1 C20.1 LED1.2 U6.4), connectors (9 pins)
A0: decoders (TP22.0), Decs/Dec0 (1U3.1), Decs/Dec1 (2U3.1), Decs/Dec2 (3U3.1), Decs/Dec3 (4U3.1), mcu (U5.30)
A1: decoders (TP21.0), Decs/Dec0 (1U3.2), Decs/Dec1 (2U3.2), Decs/Dec2 (3U3.2), Decs/Dec3 (4U3.2), mcu (U5.29)
A2: decoders (TP20.0), Decs/Dec0 (1U3.3), Decs/Dec1 (2U3.3), Decs/Dec2 (3U3.3), Decs/Dec3 (4U3.3), mcu (U5.28)
A3: decoders (TP19.0), Decs/Dec1 (2U3.6), Decs/Dec2 (3U3.5), Decs/Dec3 (4U3.6), Decs/Not1 (1U4.2), mcu (U5.26)
A4: decoders (TP18.0), Decs/Dec0 (1U3.5), Decs/Dec1 (2U3.5), Decs/Dec2 (3U3.6), Decs/Not2 (2U4.2), mcu (U5.31)
LE: decoders (TP23.0), Decs/Dec0 (1U3.4), Decs/Dec1 (2U3.4), Decs/Dec2 (3U3.4), Decs/Dec3 (4U3.4), mcu (U5.27)
MISO1: ADC1 (1U1.24), mcu (U5.91)
MISO2: mcu (U5.53), interface (LCD1.13)
MISO3: mcu (U5.80), interface (LCD1.9)
MISO4: ADC2 (2U1.24), mcu (U5.4)
MOSI1: ADC1 (1U1.21), mcu (U5.92)
MOSI2: mcu (U5.54), interface (LCD1.12)
MOSI3: mcu (U5.81), interface (LCD1.6)
MOSI4: ADC2 (2U1.21), mcu (U5.5)
Net1U1_20: ADC1 (1U1.20), mcu (U5.86)
Net1U1_25: ADC1 (1U1.25), mcu (U5.93)
Net1U3_6: decoders (TP24.0), Decs/Dec0 (1U3.6), Decs/Not1 (1U4.4)
Net2U1_20: ADC2 (2U1.20), mcu (U5.2)
Net2U1_25: ADC2 (2U1.25), mcu (U5.3)
Net2U4_4: decoders (TP57.0), Decs/Dec3 (4U3.5), Decs/Not2 (2U4.4)
NetLCD1_3: mcu (U5.84), interface (LCD1.3)
NetLCD1_4: mcu (U5.83), interface (LCD1.4 R20.1)
NetLCD1_5: mcu (U5.82), interface (LCD1.5)
NetLCD1_11: mcu (U5.55), interface (LCD1.11)
NetLCD1_14: mcu (U5.51), interface (LCD1.14)
ROW0: decoders (TP25.0), Decs/Dec0 (1U3.15)
ROW1: decoders (TP26.0), Decs/Dec0 (1U3.14)
ROW2: decoders (TP27.0), Decs/Dec0 (1U3.13)
ROW3: decoders (TP28.0), Decs/Dec0 (1U3.12)
ROW4: decoders (TP29.0), Decs/Dec0 (1U3.11)
ROW5: decoders (TP30.0), Decs/Dec0 (1U3.10)
ROW6: decoders (TP31.0), Decs/Dec0 (1U3.9)
ROW7: decoders (TP32.0), Decs/Dec0 (1U3.7)
ROW8: decoders (TP33.0), Decs/Dec1 (2U3.15)
ROW9: decoders (TP34.0), Decs/Dec1 (2U3.14)
ROW10: decoders (TP35.0), Decs/Dec1 (2U3.13)
ROW11: decoders (TP36.0), Decs/Dec1 (2U3.12)
ROW12: decoders (TP37.0), Decs/Dec1 (2U3.11)
ROW13: decoders (TP38.0), Decs/Dec1 (2U3.10)
ROW14: decoders (TP39.0), Decs/Dec1 (2U3.9)
ROW15: decoders (TP40.0), Decs/Dec1 (2U3.7)
ROW16: decoders (TP41.0), Decs/Dec2 (3U3.15)
ROW17: decoders (TP42.0), Decs/Dec2 (3U3.14)
ROW18: decoders (TP43.0), Decs/Dec2 (3U3.13)
ROW19: decoders (TP44.0), Decs/Dec2 (3U3.12)
ROW20: decoders (TP45.0), Decs/Dec2 (3U3.11)
ROW21: decoders (TP46.0), Decs/Dec2 (3U3.10)
ROW22: decoders (TP47.0), Decs/Dec2 (3U3.9)
ROW23: decoders (TP48.0), Decs/Dec2 (3U3.7)
ROW24: decoders (TP49.0), Decs/Dec3 (4U3.15)
ROW25: decoders (TP50.0), Decs/Dec3 (4U3.14)
ROW26: decoders (TP51.0), Decs/Dec3 (4U3.13)
ROW27: decoders (TP52.0), Decs/Dec3 (4U3.12)
ROW28: decoders (TP53.0), Decs/Dec3 (4U3.11)
ROW29: decoders (TP54.0), Decs/Dec3 (4U3.10)
ROW30: decoders (TP55.0), Decs/Dec3 (4U3.9)
ROW31: decoders (TP56.0), Decs/Dec3 (4U3.7)
SCK1: ADC1 (1U1.19), mcu (U5.90)
SCK2: mcu (U5.52), interface (LCD1.10)
SCK3: mcu (U5.79), interface (LCD1.7)
SCK4: ADC2 (2U1.19), mcu (U5.1)
SWCLK: mcu (U5.77), connectors (J2.2)
SWDIO: mcu (U5.76), connectors (J2.1)
USBD_N: mcu (U5.72), connectors (U7.3)
USBD_P: mcu (U5.73), connectors (U7.1)